# Altium schematic sheet Sch_Salah_Top.SchDoc
size A2; SheetNumber: 1; SheetTotal: 3
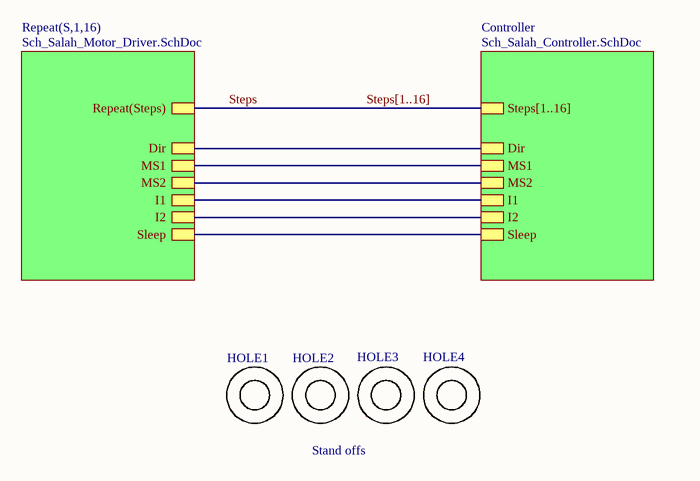
[diagram p0: Sch_Salah_Top.SchDoc]

## Parts
HOLE1  M3 Mounting Hole  [M3 STAND OFF - RING]  (value not drawn)
HOLE2  M3 Mounting Hole  [M3 STAND OFF - RING]  (value not drawn)
HOLE3  M3 Mounting Hole  [M3 STAND OFF - RING]  (value not drawn)
HOLE4  M3 Mounting Hole  [M3 STAND OFF - RING]  (value not drawn)

## Sub-sheets
Controller = Sch_Salah_Controller.SchDoc: Steps[1..16], Dir, MS1, MS2, I1, I2, Sleep
Repeat(S,1,16) = Sch_Salah_Motor_Driver.SchDoc: Repeat(Steps), Dir, MS1, MS2, I1, I2, Sleep

## Nets
Steps: sheet Repeat(S,1,16)/Repeat(Steps)
(unnamed): sheet Repeat(S,1,16)/Dir, sheet Controller/Dir
(unnamed): sheet Repeat(S,1,16)/MS1, sheet Controller/MS1
(unnamed): sheet Repeat(S,1,16)/MS2, sheet Controller/MS2
(unnamed): sheet Repeat(S,1,16)/I1, sheet Controller/I1
(unnamed): sheet Repeat(S,1,16)/I2, sheet Controller/I2
(unnamed): sheet Repeat(S,1,16)/Sleep, sheet Controller/Sleep

## Buses and harness runs
bus Steps[1..16] = sheet Controller/Steps[1..16]

## Notes on the sheet
- Stand offs